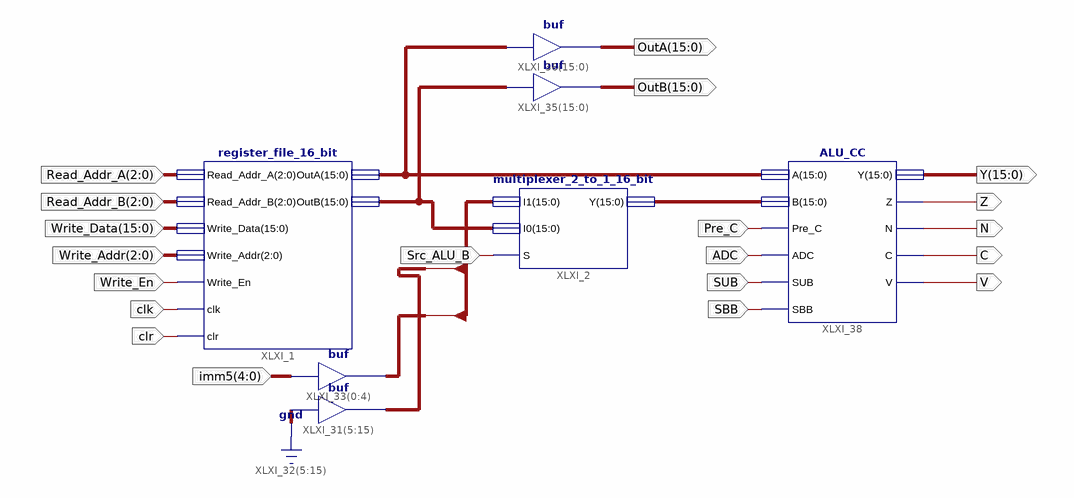
[diagram p0: schematic sheet 1]
// Xilinx ISE schematic RF_plus_ALU.sch (virtex6) as structural Verilog: 7 symbols, 20 ports
module RF_plus_ALU (
  input  [2:0] Read_Addr_A,
  input  [2:0] Read_Addr_B,
  input  [15:0] Write_Data,
  input  [2:0] Write_Addr,
  input  Write_En,
  input  clk,
  input  Pre_C,
  input  Src_ALU_B,
  input  ADC,
  input  SUB,
  input  SBB,
  input  [4:0] imm5,
  input  clr,
  output [15:0] Y,
  output Z,
  output N,
  output C,
  output V,
  output [15:0] OutA,
  output [15:0] OutB
);

  wire [15:0] imm, XLXN_3, XLXN_46, XLXN_47;

  multiplexer_2_to_1_16_bit XLXI_2 (.I0(XLXN_47), .I1(imm), .S(Src_ALU_B), .Y(XLXN_3));
  assign imm[15:5] = {11{1'b0}};  // buf XLXI_31[5..15], 11 bits wide
  assign OutB = XLXN_47;  // buf XLXI_35[15..0], 16 bits wide
  assign OutA = XLXN_46;  // buf XLXI_36[15..0], 16 bits wide
  ALU_CC XLXI_38 (
    .A(XLXN_46), .B(XLXN_3), .Pre_C(Pre_C), .ADC(ADC), .SUB(SUB), .SBB(SBB), .N(N), .Z(Z), .Y(Y), .C(C), .V(V));
  assign imm[4:0] = imm5;  // buf XLXI_33[0..4], 5 bits wide
  register_file_16_bit XLXI_1 (
    .clk(clk), .clr(clr), .OutA(XLXN_46), .OutB(XLXN_47), .Read_Addr_A(Read_Addr_A),
    .Read_Addr_B(Read_Addr_B), .Write_Addr(Write_Addr), .Write_Data(Write_Data), .Write_En(Write_En));
endmodule
